# EAGLE schematic Lab 3 (EAGLE 9.3.0)
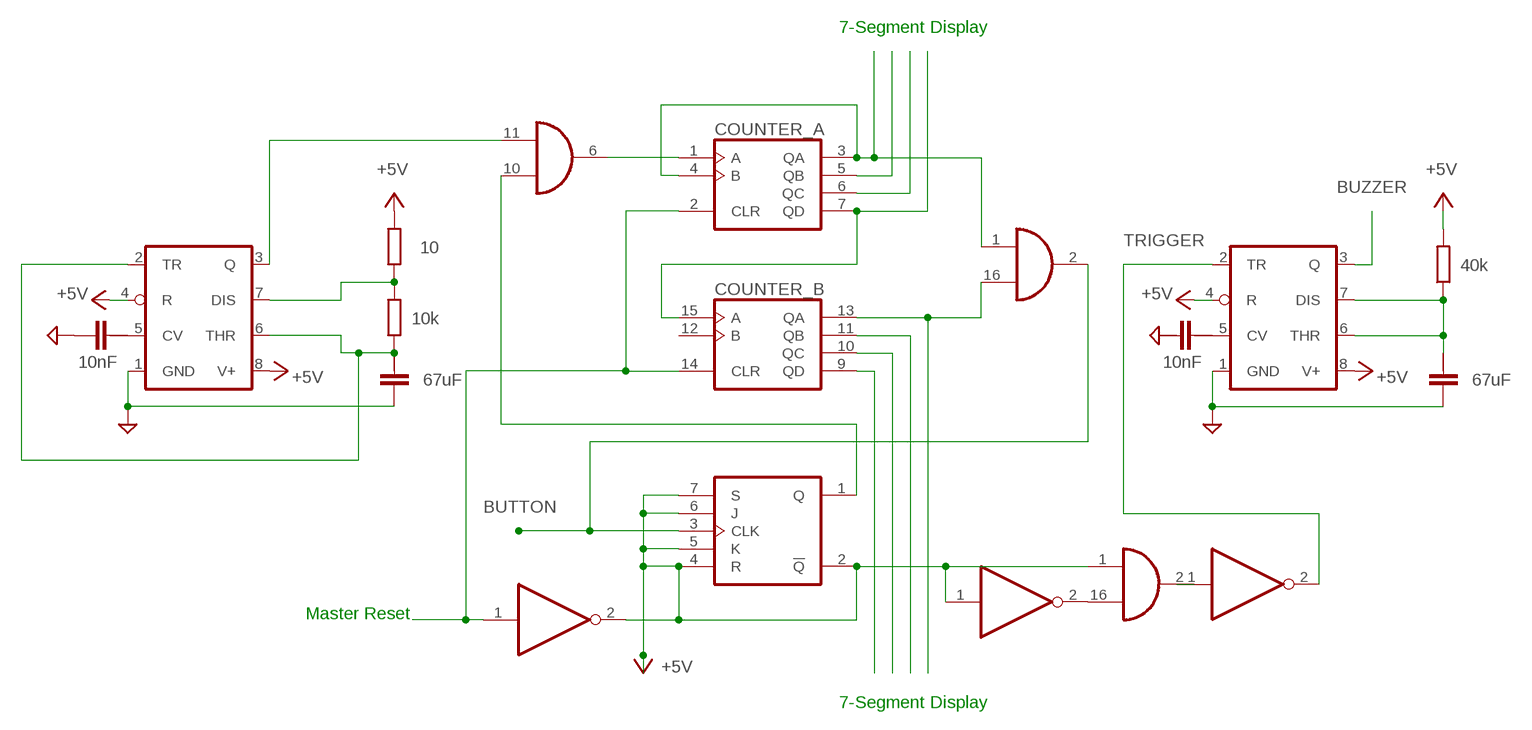
[diagram p0: schematic, sheet 1]

## Parts
AND_GATE_  74AC11008  [DIL16]
AND_GATE_1  74AC11008  [DIL16]
C1  10nF  C-2.5-5/4  [C2.5/5-4]
C2  67uF  C-2.5-5/4  [C2.5/5-4]
C3  67uF  C-2.5-5/4  [C2.5/5-4]
C4  10nF  C-2.5-5/4  [C2.5/5-4]
COUNTER_  74AC390N  [DIL16]
IC1  LM555D  [SO08]
IC2  LM555D  [SO08]
JK_FLIP-FLOP_  4027N  [DIL16]
NOT_GATE_  74ALS04N  [DIL14]
NOT_GATE_1  74ALS04N  [DIL14]
NOT_GATE_2  74ALS04N  [DIL14]
R1  40k  R-EU_0204/7  [0204/7]
R2  10  R-EU_0204/7  [0204/7]
R3  10k  R-EU_0204/7  [0204/7]

## Nets
+5V: AND_GATE_1.1(A:I0) IC1.4(R) IC1.8(V+) IC2.4(R) IC2.8(V+) JK_FLIP-FLOP_.2(A:!Q) JK_FLIP-FLOP_.4(A:R) JK_FLIP-FLOP_.5(A:K) JK_FLIP-FLOP_.6(A:J) JK_FLIP-FLOP_.7(A:S) NOT_GATE_1.1(A:I) NOT_GATE_.2(A:O) R1.2 R2.2
BUTTON: AND_GATE_.2(A:O) JK_FLIP-FLOP_.3(A:CLK)
BUZZER: IC1.3(Q)
CLK: AND_GATE_.11(C:I0) IC2.3(Q)
GND: C2.1 C3.1 C4.1 IC1.1(GND) IC2.1(GND)
N$1: AND_GATE_.1(A:I0) COUNTER_.3(A:QA) COUNTER_.4(A:B)
N$2: COUNTER_.7(A:QD) COUNTER_.15(B:A)
N$4: AND_GATE_.10(C:I1) JK_FLIP-FLOP_.1(A:Q)
N$5: AND_GATE_.16(A:I1) COUNTER_.13(B:QA)
N$6: AND_GATE_1.16(A:I1) NOT_GATE_1.2(A:O)
N$7: AND_GATE_1.2(A:O) NOT_GATE_2.1(A:I)
N$8: C1.2 IC1.5(CV)
N$9: COUNTER_.5(A:QB)
N$10: C2.2 IC1.6(THR) IC1.7(DIS) R1.1
N$11: COUNTER_.6(A:QC)
N$12: COUNTER_.9(B:QD)
N$13: COUNTER_.10(B:QC)
N$14: COUNTER_.11(B:QB)
N$15: AND_GATE_.6(C:O) COUNTER_.1(A:A)
N$16: COUNTER_.2(A:CLR) COUNTER_.14(B:CLR) NOT_GATE_.1(A:I)
N$17: C4.2 IC2.5(CV)
N$19: IC2.7(DIS) R2.1 R3.2
N$20: C3.2 IC2.2(TR) IC2.6(THR) R3.1
TRIGGER: IC1.2(TR) NOT_GATE_2.2(A:O)
Unconnected: AND_GATE_1.3(B:O) AND_GATE_1.6(C:O) AND_GATE_1.7(D:O) AND_GATE_1.8(D:I1) AND_GATE_1.9(D:I0) AND_GATE_1.10(C:I1) AND_GATE_1.11(C:I0) AND_GATE_1.14(B:I1) AND_GATE_1.15(B:I0) AND_GATE_.3(B:O) AND_GATE_.7(D:O) AND_GATE_.8(D:I1) AND_GATE_.9(D:I0) AND_GATE_.14(B:I1) AND_GATE_.15(B:I0) C1.1 C1.3 C2.3 C3.3 C4.3 COUNTER_.12(B:B) JK_FLIP-FLOP_.9(B:S) JK_FLIP-FLOP_.10(B:J) JK_FLIP-FLOP_.11(B:K) JK_FLIP-FLOP_.12(B:R) JK_FLIP-FLOP_.13(B:CLK) JK_FLIP-FLOP_.14(B:!Q) JK_FLIP-FLOP_.15(B:Q) NOT_GATE_1.3(B:I) NOT_GATE_1.4(B:O) NOT_GATE_1.5(C:I) NOT_GATE_1.6(C:O) NOT_GATE_1.8(D:O) NOT_GATE_1.9(D:I) NOT_GATE_1.10(E:O) NOT_GATE_1.11(E:I) NOT_GATE_1.12(F:O) NOT_GATE_1.13(F:I) NOT_GATE_2.3(B:I) NOT_GATE_2.4(B:O) NOT_GATE_2.5(C:I) NOT_GATE_2.6(C:O) NOT_GATE_2.8(D:O) NOT_GATE_2.9(D:I) NOT_GATE_2.10(E:O) NOT_GATE_2.11(E:I) NOT_GATE_2.12(F:O) NOT_GATE_2.13(F:I) NOT_GATE_.3(B:I) NOT_GATE_.4(B:O) NOT_GATE_.5(C:I) NOT_GATE_.6(C:O) NOT_GATE_.8(D:O) NOT_GATE_.9(D:I) NOT_GATE_.10(E:O) NOT_GATE_.11(E:I) NOT_GATE_.12(F:O) NOT_GATE_.13(F:I)

## Notes on the sheet
- 7-Segment Display
- Master Reset
- 7-Segment Display

## Power pins joined to a net without a drawn wire
GND: AND_GATE_1.4(P:GND) AND_GATE_1.5(P:GND) AND_GATE_.4(P:GND) AND_GATE_.5(P:GND) COUNTER_.8(P:GND) NOT_GATE_1.7(P:GND) NOT_GATE_2.7(P:GND) NOT_GATE_.7(P:GND)
VCC: AND_GATE_1.12(P:VCC) AND_GATE_1.13(P:VCC) AND_GATE_.12(P:VCC) AND_GATE_.13(P:VCC) COUNTER_.16(P:VCC) NOT_GATE_1.14(P:VCC) NOT_GATE_2.14(P:VCC) NOT_GATE_.14(P:VCC)
VDD: JK_FLIP-FLOP_.16(P:VDD)
VSS: JK_FLIP-FLOP_.8(P:VSS)

## Library data of the parts
AND_GATE_ AND_GATE_1 = 74ac-logic:74AC11008: Quadruple 2-input AND
C1-C4 = capacitor-wima:C-: CAPACITOR for alternative placement naming: default grid - extended grid/package width
COUNTER_ = 74xx-eu:74*390: Dual 4-bit decade and binary COUNTER
IC1 IC2 = linear:*555: TIMER
JK_FLIP-FLOP_ = 40xx:4027: Dual JK FLIP FLOP
NOT_GATE_ NOT_GATE_1 NOT_GATE_2 = 74xx-us:74*04: Hex INVERTER
R1-R3 = rcl:R-EU_: RESISTOR, European symbol; SPICEPREFIX: R